# EAGLE design Arduino Uno Data Logger with DHT (EAGLE 7.4.0)
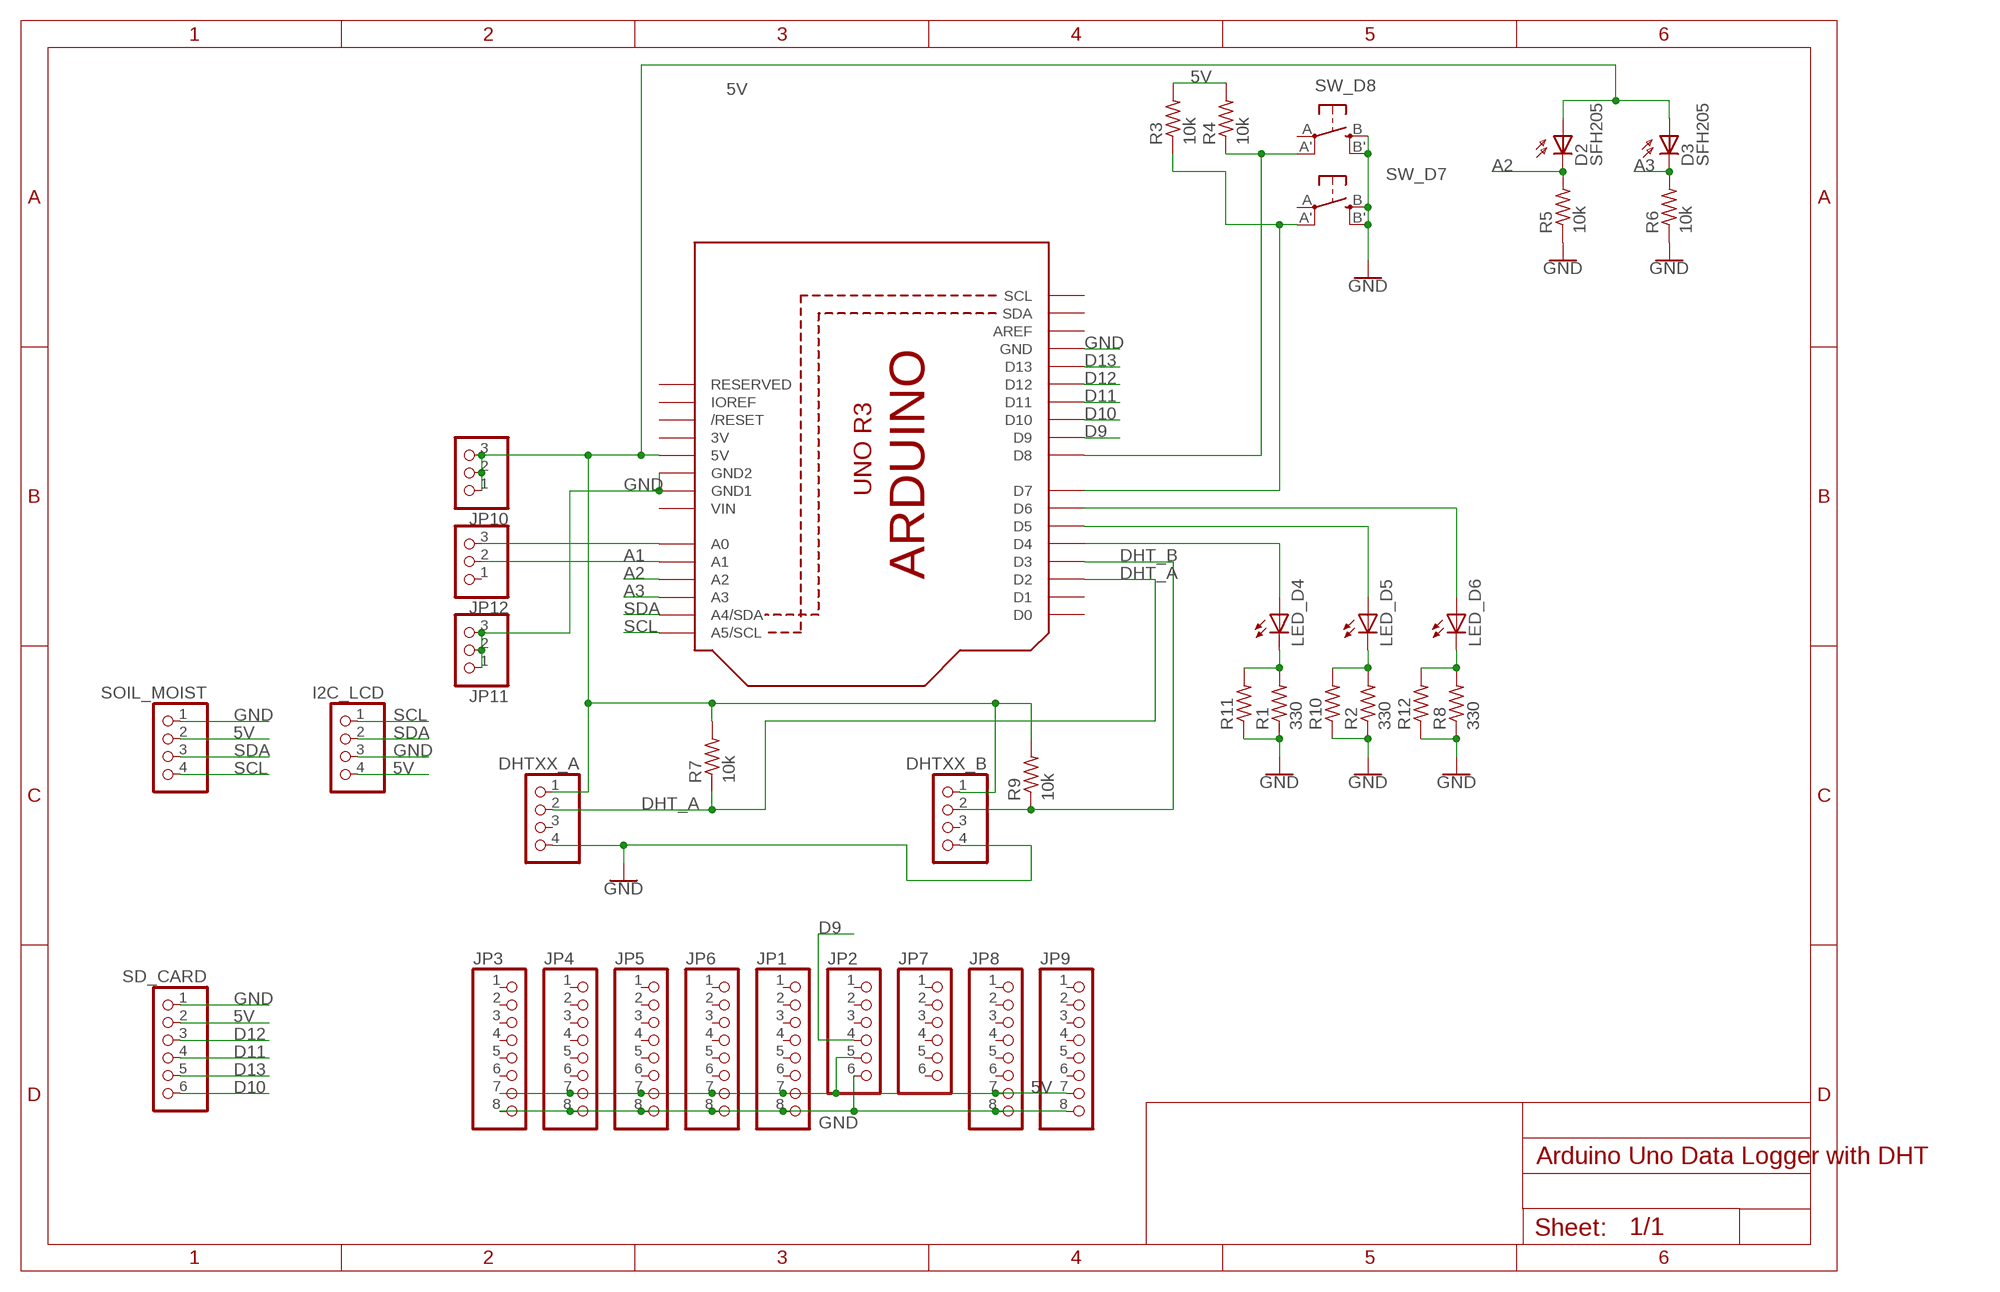
[diagram p0: schematic, sheet 1]

## Parts
D2  SFH205  [SFH205]
D3  SFH205  [SFH205]
DHTXX_A  PINHD-1X4  [1X04]
DHTXX_B  PINHD-1X4  [1X04]
I2C_LCD  PINHD-1X4  [1X04]
JP1  PINHD-1X8CLEANBIG  [1X08-CLEANBIG]
JP2  PINHD-1X6CB  [1X06-CLEANBIG]
JP3  PINHD-1X8CLEANBIG  [1X08-CLEANBIG]
JP4  PINHD-1X8CLEANBIG  [1X08-CLEANBIG]
JP5  PINHD-1X8CLEANBIG  [1X08-CLEANBIG]
JP6  PINHD-1X8CLEANBIG  [1X08-CLEANBIG]
JP7  PINHD-1X6CB  [1X06-CLEANBIG]
JP8  PINHD-1X8CLEANBIG  [1X08-CLEANBIG]
JP9  PINHD-1X8CLEANBIG  [1X08-CLEANBIG]
JP10  PINHD-1X3CB  [1X03-CLEANBIG]
JP11  PINHD-1X3CB  [1X03-CLEANBIG]
JP12  PINHD-1X3CB  [1X03-CLEANBIG]
LED_D4  LED5MM  [LED5MM]
LED_D5  LED5MM  [LED5MM]
LED_D6  LED5MM  [LED5MM]
R1  330  R-US_0207/10  [0207/10]
R2  330  R-US_0207/10  [0207/10]
R3  10k  R-US_0207/10  [0207/10]
R4  10k  R-US_0207/10  [0207/10]
R5  10k  R-US_0207/10  [0207/10]
R6  10k  R-US_0207/10  [0207/10]
R7  10k  R-US_0207/10  [0207/10]
R8  330  R-US_0207/10  [0207/10]
R9  10k  R-US_0207/10  [0207/10]
R10  R-US_R2010  [R2010]
R11  R-US_R2010  [R2010]
R12  R-US_R2010  [R2010]
SD_CARD  PINHD-1X6  [1X06]
SOIL_MOIST  PINHD-1X4  [1X04]
SW_D7  SPST_TACT-EVQQ2  [EVQ-Q2]
SW_D8  SPST_TACT-EVQQ2  [EVQ-Q2]
U1  ARDUINOR3-DIMENSION  [ARDUINOR3]

## Nets
5V: D2.A D3.A DHTXX_A.1 DHTXX_B.1 I2C_LCD.4 JP1.7 JP2.5 JP3.7 JP4.7 JP5.7 JP6.7 JP8.7 JP9.7 JP10.1 JP10.2 JP10.3 R3.2 R4.2 R7.2 R9.2 SD_CARD.2 SOIL_MOIST.2 U1.5V
A1: JP12.2 U1.A1
A2: D2.K(C) R5.2 U1.A2
A3: D3.K(C) R6.2 U1.A3
D9: JP2.4 U1.D9
D10: SD_CARD.6 U1.D10
D11: SD_CARD.4 U1.D11
D12: SD_CARD.3 U1.D12
D13: SD_CARD.5 U1.D13
DHT_A: DHTXX_A.2 R7.1 U1.D2
DHT_B: DHTXX_B.2 R9.1 U1.D3
GND: DHTXX_A.4 DHTXX_B.4 I2C_LCD.3 JP1.8 JP2.6 JP3.8 JP4.8 JP5.8 JP6.8 JP8.8 JP9.8 JP11.1 JP11.2 JP11.3 R1.1 R2.1 R5.1 R6.1 R8.1 R10.1 R11.1 R12.1 SD_CARD.1 SOIL_MOIST.1 SW_D7.B'(S1) SW_D7.B(S) SW_D8.B'(S1) SW_D8.B(S) U1.GND U1.GND1 U1.GND2
N$1: R4.1 SW_D8.A'(P1) U1.D8
N$2: R3.1 SW_D7.A'(P1) U1.D7
N$3: LED_D5.K(C) R2.2 R10.2
N$4: LED_D4.A U1.D4
N$5: LED_D4.K(C) R1.2 R11.2
N$6: LED_D5.A U1.D5
N$8: LED_D6.A U1.D6
N$10: LED_D6.K(C) R8.2 R12.2
N$12: JP12.3 U1.A0
SCL: I2C_LCD.1 SOIL_MOIST.4 U1.A5(A5/SCL)
SDA: I2C_LCD.2 SOIL_MOIST.3 U1.A4(A4/SDA)
Unconnected: DHTXX_A.3 DHTXX_B.3 JP1.1 JP1.2 JP1.3 JP1.4 JP1.5 JP1.6 JP2.1 JP2.2 JP2.3 JP3.1 JP3.2 JP3.3 JP3.4 JP3.5 JP3.6 JP4.1 JP4.2 JP4.3 JP4.4 JP4.5 JP4.6 JP5.1 JP5.2 JP5.3 JP5.4 JP5.5 JP5.6 JP6.1 JP6.2 JP6.3 JP6.4 JP6.5 JP6.6 JP7.1 JP7.2 JP7.3 JP7.4 JP7.5 JP7.6 JP8.1 JP8.2 JP8.3 JP8.4 JP8.5 JP8.6 JP9.1 JP9.2 JP9.3 JP9.4 JP9.5 JP9.6 JP12.1 SW_D7.A(P) SW_D8.A(P) U1.AREF U1.D0 U1.D1 U1.IOREF U1.RESERVED U1.RESET(/RESET) U1.SCL U1.SDA

## Power pins joined to a net without a drawn wire
3V: U1.3V
VIN: U1.VIN

## Library data of the parts
D2 D3 = opto-trans-siemens:SFH205: PHOTO DIODE; OC_FARNELL: unknown; OC_NEWARK: unknown
DHTXX_A DHTXX_B I2C_LCD SOIL_MOIST = pinhead:PINHD-1X4: PIN HEADER
JP1 JP3-JP6 JP8 JP9 = adafruit:PINHD-1X8: PIN HEADER
JP2 JP7 = adafruit:PINHD-1X6: PIN HEADER
JP10-JP12 = adafruit:PINHD-1X3: PIN HEADER
LED_D4-LED_D6 = adafruit:LED: LED OSRAM: - CHIPLED LG R971, LG N971, LY N971, LG Q971, LY Q971, LO R971, LY R971 LH N974, LH R974 LS Q976, LO Q976, LY Q976 LO Q996 - Hyper CHIPLED LW Q18S LB Q993, LB Q99A, LB R99A - SideLED LS A670, LO A670, LY A670, LG A670, LP A670 LB A673, LV A673, LT A673, LW A673 LH A674 LY A675 LS A676, LA A676, LO A676, LY A676, LW A676 LS A679, LY A679, LG A679 - Hyper Micro SIDELED® LS Y876, LA Y876, LO Y876, LY Y876 LT Y87S - SmartLED LW L88C, LW L88S LB L89C, LB L89S, LG L890 LS L89K, LO L89K, LY L89K LS L896, LA L896, LO L896, LY L896 - TOPLED LS T670, LO T670, LY T670, LG T670, LP T670 LSG T670, LSP T670, LSY T670, LOP T670, LYG T670 LG T671, LOG T671, LSG T671 LB T673, LV T673, LT T673, LW T673 LH T674 LS T676, LA T676, LO T676, LY T676, LB T676, LH T676, LSB T676, LW T676 LB T67C, LV T67C, LT T67C, LS T67K, LO T67K, LY T67K, LW E67C LS E67B, LA E67B, LO E67B, LY E67B, LB E67C, LV E67C, LT E67C LW T67C LS T679, LY T679, LG T679 LS T770, LO T770, LY T770, LG T770, LP T770 LB T773, LV T773, LT T773, LW T773 LH T774 LS E675, LA E675, LY E675, LS T675 LS T776, LA T776, LO T776, LY T776, LB T776 LHGB T686 LT T68C, LB T68C - Hyper Mini TOPLED® LB M676 - Mini TOPLED Santana® LG M470 LS M47K, LO M47K, LY M47K Source: http://www.osram.convergy.de/
R1-R12 = adafruit:R-US_: RESISTOR, American symbol
SD_CARD = pinhead:PINHD-1X6: PIN HEADER
SW_D7 SW_D8 = adafruit:SPST_TACT: SMT 6mm switch, EVQQ2 series http://www.ladyada.net/library/eagle
U1 = adafruit:ARDUINOR3: This is a new object for the new Arduino R3 - with extra pins that you may want to use (such as IOref, and duplicated A4/A5

## Board
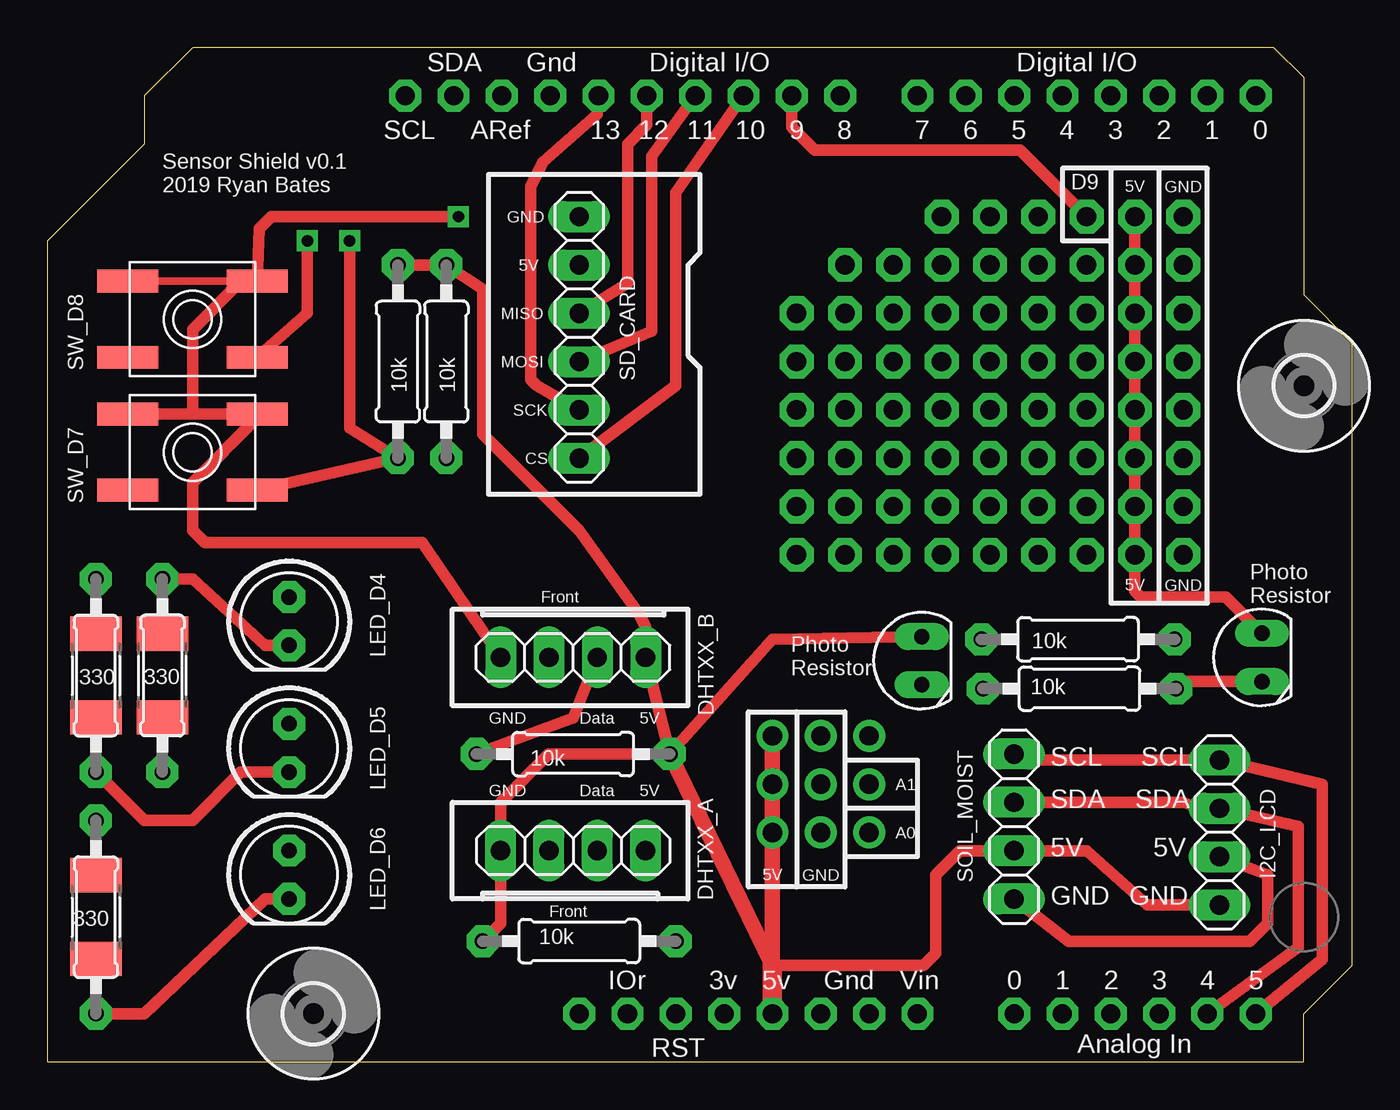
[diagram p1: board, top side]
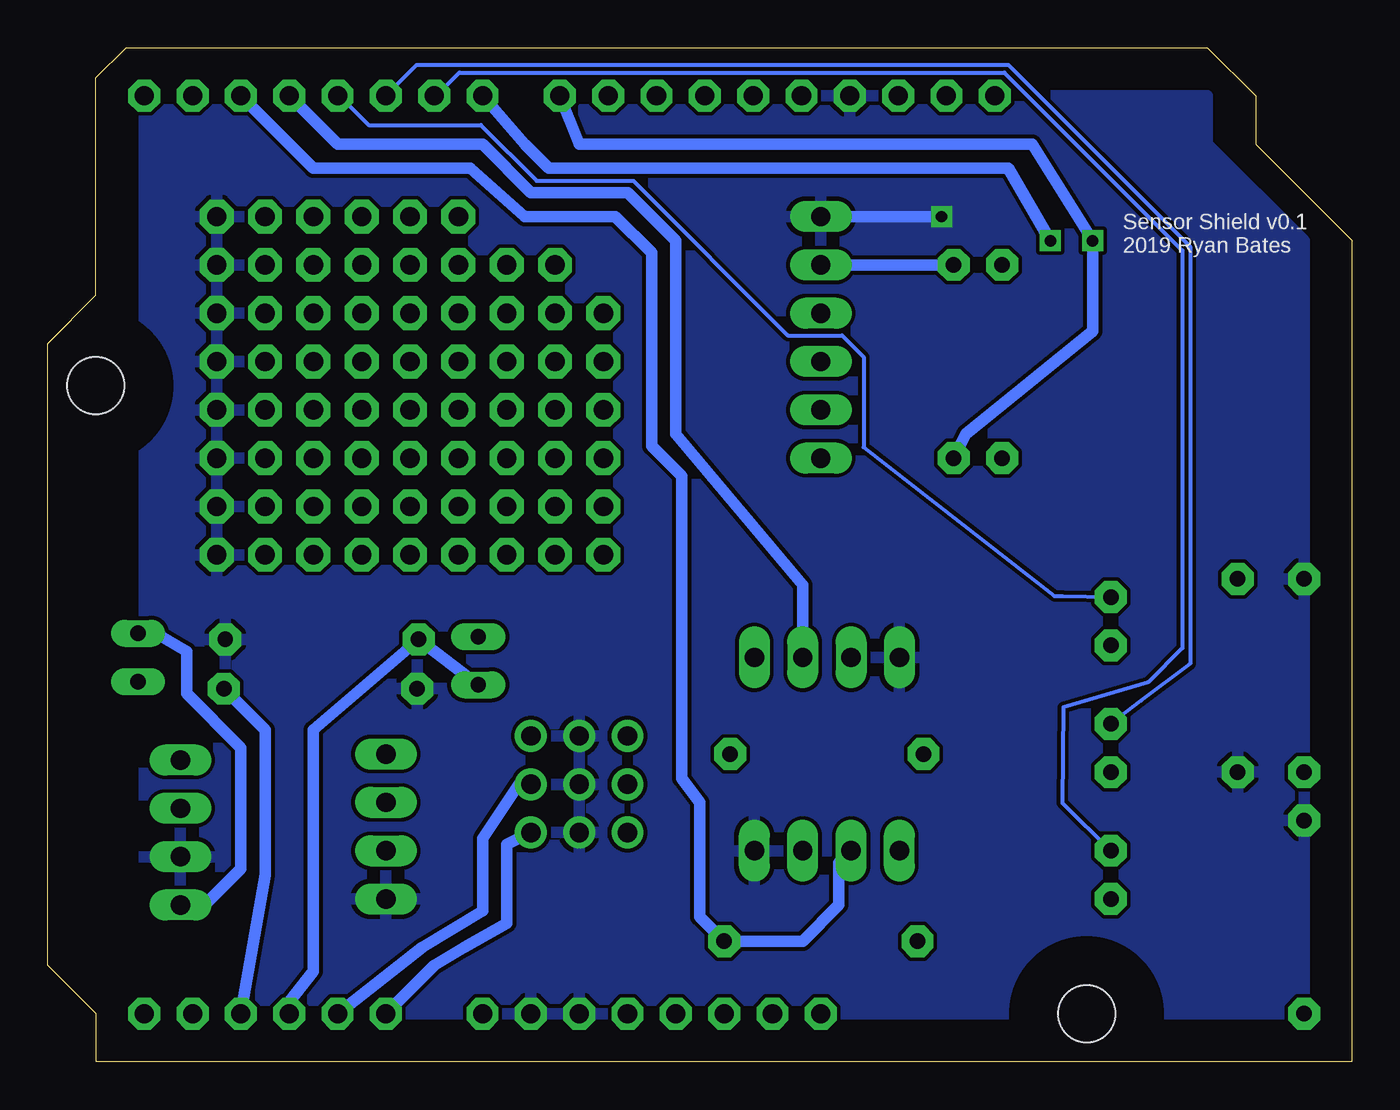
[diagram p2: board, bottom side, seen from below]

Size 68.58 x 53.34 mm. Coordinates in mm from the lower left corner, seen from the top.
Outline: 0,0 66.03,0 66.03,2.53 68.58,5.08 68.58,37.78 66.04,40.32 66.04,51.75 64.45,53.34 7.62,53.34 5.08,50.8 5.08,48.26 0,43.18 0,0
Copper layers (1*16): Top 0.035mm / dielectric 1.5mm / Bottom 0.035mm
Design rules "SparkFun": minimum track width 8mil, minimum drill 20mil, track to track 8mil, track to pad 8mil, pad to pad 8mil, via to via 8mil, smd to smd 8mil, copper to edge 8mil, drill to drill 8mil, minimum pad ring 12mil, minimum via ring 10mil, stop-mask expansion 4mil, vias tented up to drill 20mil, thermal gap 10mil

### Footprints (pad centres in the part's own frame; a part is rotated, then mirrored left to right if it is on the bottom)
SFH205 = drill 0.813 long: A 0,-1.27; K 0,1.27
1X04 = drill 1.016 long: 1 -3.81,0; 2 -1.27,0; 3 1.27,0; 4 3.81,0
1X08-CLEANBIG = drill 1.016 pad 1.778 octagon: 1 -8.89,0; 2 -6.35,0; 3 -3.81,0; 4 -1.27,0; 5 1.27,0; 6 3.81,0; 7 6.35,0; 8 8.89,0
1X06-CLEANBIG = drill 1.016 pad 1.778 octagon: 1 -6.35,0; 2 -3.81,0; 3 -1.27,0; 4 1.27,0; 5 3.81,0; 6 6.35,0
1X03-CLEANBIG = drill 1.016 pad 1.676: 1 -2.54,0; 2 0,0; 3 2.54,0
LED5MM = drill 0.813 pad 1.676 octagon: A -1.27,0; K 1.27,0
0207/10 = drill 0.813 pad 1.676 octagon: 1 -5.08,0; 2 5.08,0
R2010 = smd 1.8 x 2.7: 1 -2.2,0; 2 2.2,0
1X06 = drill 1.016 long: 1 -6.35,0; 2 -3.81,0; 3 -1.27,0; 4 1.27,0; 5 3.81,0; 6 6.35,0
EVQ-Q2 = smd 3.2 x 1.2: A -3.4,-2; A' 3.4,-2; B -3.4,2; B' 3.4,2
ARDUINOR3 = drill 1 pad 1.676 octagon: 3V 35.56,2.54; 5V 38.1,2.54; A0 50.8,2.54; A1 53.34,2.54; A2 55.88,2.54; A3 58.42,2.54; A4 60.96,2.54; A5 63.5,2.54; AREF 23.876,50.8; D0 63.5,50.8; D1 60.96,50.8; D2 58.42,50.8; D3 55.88,50.8; D4 53.34,50.8; D5 50.8,50.8; D6 48.26,50.8; D7 45.72,50.8; D8 41.656,50.8; D9 39.116,50.8; D10 36.576,50.8; D11 34.036,50.8; D12 31.496,50.8; D13 28.956,50.8; GND 26.416,50.8; GND1 43.18,2.54; GND2 40.64,2.54; IOREF 30.48,2.54; RESERVED 27.94,2.54; RESET 33.02,2.54; SCL 18.796,50.8; SDA 21.336,50.8; VIN 45.72,2.54
3,0 = hole 3: 0,0

### Placement (x,y rotation side)
D2  45.94,21.1 180 top
D3  63.82,21.27 180 top
DHTXX_A  27.62,11.11 0 top
DHTXX_B  27.62,21.27 180 top
I2C_LCD  61.59,12.06 270 top
JP1  50.8,41.91 0 top
JP2  53.34,44.45 0 top
JP3  50.8,39.37 0 top
JP4  50.8,36.83 0 top
JP5  50.8,34.29 0 top
JP6  50.8,31.75 0 top
JP7  39.37,33.02 90 top
JP8  50.8,29.21 0 top
JP9  50.8,26.67 0 top
JP10  38.1,14.61 90 top
JP11  40.64,14.61 90 top
JP12  43.18,14.61 270 top
LED_D4  12.7,23.18 270 top
LED_D5  12.7,16.51 270 top
LED_D6  12.7,9.84 270 top
R1  6.03,20.32 90 top
R2  2.54,20.32 270 top
R3  18.41,36.83 90 top
R4  20.95,36.83 90 top
R5  54.16,22.23 180 top
R6  54.24,19.63 0 top
R7  27.94,6.35 180 top
R8  2.54,7.62 270 top
R9  27.62,16.19 0 top
R10  2.54,20.32 270 top
R11  6.03,20.32 90 top
R12  2.54,7.62 270 top
SD_CARD  27.94,38.1 270 top
SOIL_MOIST  50.8,12.38 90 top
SW_D7  7.62,32.07 0 top
SW_D8  7.62,39.05 0 top
U1  0,0 0 top
U$1  [3,0]  13.97,2.54 0 top
U$3  [3,0]  66.04,35.56 0 top

### Tracks (layer width: path | path; a pad name or v marks a point on that pad's centre or on a via)
5V
  Top 0.61: I2C_LCD.4 57.78,8.26 54.61,11.11 SOIL_MOIST.2 47.94,11.11 46.67,9.84 46.67,5.71 46.04,5.08 38.1,5.08 | R3.2 R4.2 22.86,40.64 22.86,33.02 27.94,27.94 31.11,23.5 31.43,22.86 DHTXX_B.1 R9.2 | R9.2 38.1,22.23 D2.A | R9.2 26.35,16.19 23.81,13.65 DHTXX_A.1 23.81,7.3 R7.2 | JP10.1 JP10.2 JP10.3 | JP2.5 JP1.7 JP3.7 JP4.7 JP5.7 JP6.7 JP8.7 JP9.7 57.15,24.77 57.47,24.45 61.91,24.45 D3.A
  Top 0.813: R9.2 38.1,5.08 JP10.3
  Top 1.016: 38.1,5.08 U1.5V
  Bottom 0.61: SD_CARD.2 R4.2 | D3.A 62.87,22.54 61.28,21.59 61.28,19.37 58.42,16.51 58.42,10.16 60.33,8.26 I2C_LCD.4
A1
  Bottom 0.61: JP12.2 43.81,14.61 45.72,11.75 45.72,7.94 48.9,6.03 U1.A1
A2
  Bottom 0.61: D2.K R5.2 54.61,17.46 54.61,4.76 55.88,3.17 U1.A2
A3
  Top 0.61: D3.K 59.69,20 R6.2
  Bottom 0.61: R6.2 57.15,17.46 57.15,9.84 U1.A3
D9
  Top 0.61: U1.D9 39.12,49.15 40.32,47.94 51.12,47.94 JP2.4
D10
  Top 0.61: U1.D10 33.02,45.72 33.02,35.56 SD_CARD.6
D11
  Top 0.61: U1.D11 31.75,47.62 31.75,38.42 SD_CARD.4
D12
  Top 0.61: U1.D12 31.5,49.28 30.48,48.26 30.48,40.96 SD_CARD.3
D13
  Top 0.61: U1.D13 28.89,50.74 28.89,49.85 26.04,47.31 25.4,46.04 25.4,35.88 25.72,35.56 SD_CARD.5
DHT_A
  Bottom 0.61: U1.D2 54.61,46.99 46.35,46.99 43.5,44.45 38.73,44.45 36.83,42.55 36.83,32.38 35.24,30.8 35.24,14.92 34.29,13.65 34.29,7.62 R7.1 28.89,6.35 26.99,8.26 26.99,10.48 DHTXX_A.2
DHT_B
  Top 0.61: R9.1 27.62,18.1 DHTXX_B.2
  Bottom 0.61: U1.D3 53.34,48.26 45.72,48.26 43.18,45.72 38.1,45.72 35.56,43.18 35.56,33.02 28.89,25.08 DHTXX_B.2
GND  (via drill 0.6)
  Top 0.406: SW_D8.B 10.16,41.05 SW_D8.B'
  Top 0.61: I2C_LCD.3 64.14,9.84 64.14,7.3 63.18,6.35 53.66,6.35 SOIL_MOIST.1 | 7.62,34.07 7.62,38.51 10.16,41.05 | SW_D8.B' 11.11,43.81 11.75,44.45 v21.59,44.45 | SW_D7.B 7.62,34.07 | 7.62,34.07 SW_D7.B' 11.02,33.88 7.62,30.48 7.62,27.94 8.26,27.3 19.68,27.3 DHTXX_B.4 | R11.1 R1.1 | R2.1 R10.1 | R8.1 R12.1
  Bottom 0.61: v21.59,44.45 SD_CARD.1
  pour Bottom: 7.62,50.8 63.5,50.8 63.5,2.54 2.54,2.54 2.54,43.18 7.62,48.26
N$1  (via drill 0.6)
  Top 0.61: v13.65,43.18 13.65,39.37 SW_D8.A'
  Bottom 0.61: U1.D8 40.64,48.26 16.83,48.26 v13.65,43.18 13.65,38.42 20.32,33.02 R4.1
N$2  (via drill 0.6)
  Top 0.61: v15.88,43.18 15.88,33.34 R3.1 SW_D7.A'
  Bottom 0.61: U1.D7 43.5,48.26 42.23,46.99 18.1,46.99 v15.88,43.18
N$3
  Top 0.61: LED_D5.K 10.16,15.24 7.62,12.7 5.08,12.7 R2.2 R10.2
N$4
  Bottom 0.203: LED_D4.A 15.24,24.5 15.65,24.5 25.69,32.32 25.69,37.07 26.82,38.2 29.67,38.2 37.8,46.33 42.88,46.33 45.81,49.26 51.7,49.26 53.24,50.8 U1.D4
N$5
  Top 0.61: LED_D4.K 11.43,21.91 7.62,25.4 R1.2 R11.2
N$6
  Bottom 0.203: LED_D5.A 11.11,18.99 8.53,20.93 8.53,42.88 18.09,52.43 49.17,52.43 U1.D5
N$8
  Bottom 0.203: LED_D6.A 15.24,13.61 15.19,18.64 10.74,19.96 8.94,21.77 8.94,42.67 18.29,52.02 46.94,52.02 48.16,50.8 U1.D6
N$10
  Top 0.61: LED_D6.K 11.43,8.57 5.08,2.54 R8.2 R12.2
N$12
  Bottom 0.61: U1.A0 48.26,5.08 46.67,6.03 44.45,7.3 44.45,11.43 JP12.3
SCL
  Top 0.61: U1.A5 66.99,5.4 66.99,14.61 I2C_LCD.1 51.75,15.88 SOIL_MOIST.4
SDA
  Top 0.61: U1.A4 65.72,6.03 65.72,12.38 I2C_LCD.2 60.64,13.34 59.69,13.65 SOIL_MOIST.3

### Text on the board
tPlace: D9 | Sensor Shield v0.1 / 2019 Ryan Bates | 5V | GND | GND | 5V | MISO | MOSI | SCK | CS | Front | 5V | GND | Photo / Resistor | Photo / Resistor | GND | Data | 5V | SCL | SCL | GND | Data | 5V | A1 | SDA | SDA | A0 | 5V | 5V | 5V | GND | Front | GND | GND
bPlace: Sensor Shield v0.1 / 2019 Ryan Bates